# EAGLE design firealarm (EAGLE 9.6.2)
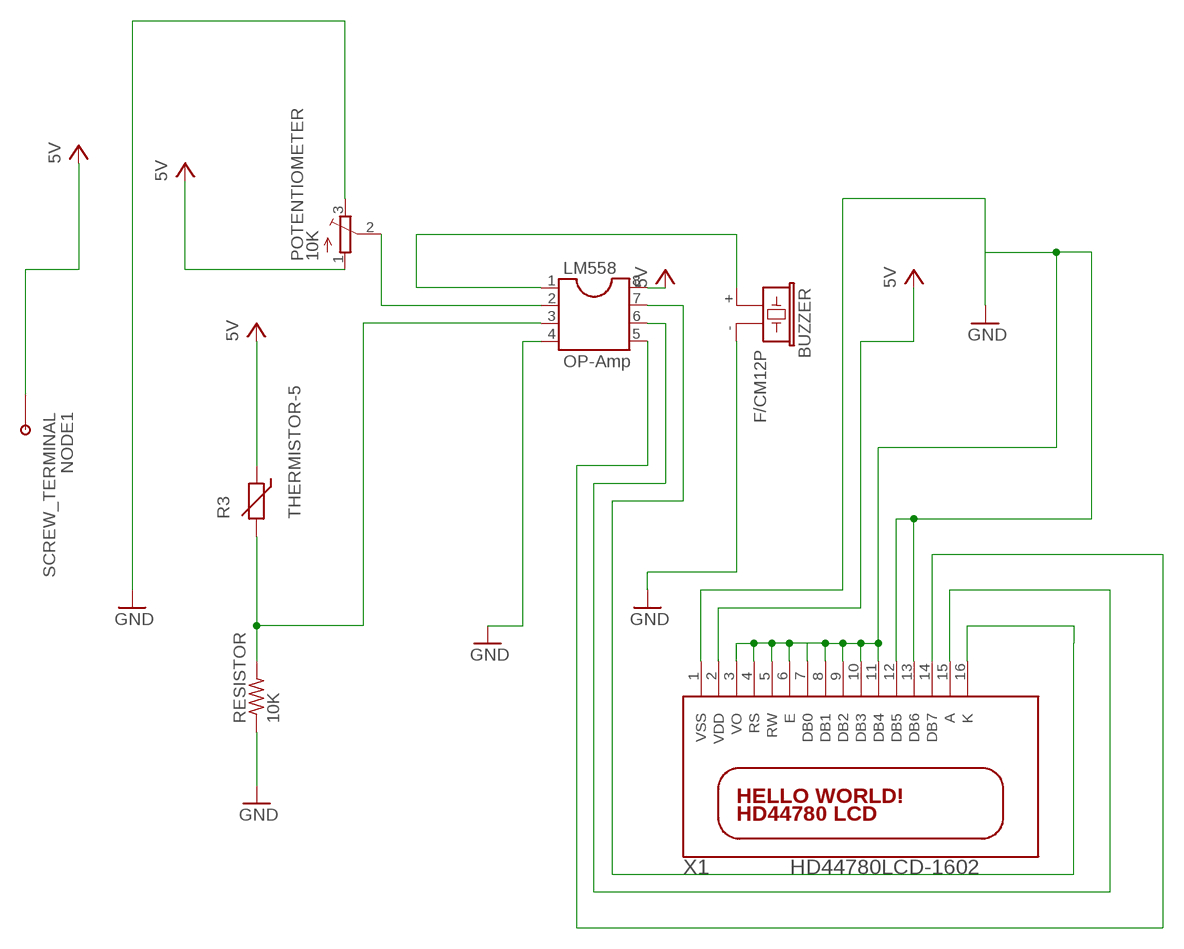
[diagram p0: schematic, sheet 1]

## Parts
BUZZER  F/CM12P  [F/CM12P]
LM558  OP-Amp  DIL8S  [SOCKET-08]
NODE1  SCREW_TERMINAL  PCB_SCREW_TERMINAL  [NINIGI_PCB_1M4]
POTENTIOMETER  10K  TRIM_EU-3223G  [3223G]
R3  THERMISTOR-5  [R-5]
RESISTOR  10K  R-US_0204/2V  [0204V]
X1  HD44780LCD-1602  [LCD1602]

## Nets
GND: BUZZER.- LM558.4 POTENTIOMETER.3(E) RESISTOR.1 X1.1(VSS) X1.3(VO) X1.4(RS) X1.5(RW) X1.6(E) X1.8(DB1) X1.9(DB2) X1.10(DB3) X1.11(DB4) X1.12(DB5) X1.13(DB6)
N$1: BUZZER.+ LM558.1
N$2: LM558.3 R3.2 RESISTOR.2
N$3: LM558.2 POTENTIOMETER.2(S)
N$5: LM558.7 X1.16(K)
N$6: LM558.5 X1.14(DB7)
N$9: LM558.6 X1.15(A)
N$11: X1.7(DB0)
VCC: LM558.8 NODE1.1 NODE1.2 NODE1.3 NODE1.4 NODE1.C POTENTIOMETER.1(A) R3.1 X1.2(VDD) ; supply symbol labelled 5V

## Library data of the parts
BUZZER = buzzer:F/CM12P: BUZZER Source: Buerklin; OC_FARNELL: unknown; OC_NEWARK: unknown
LM558 = ic-package:DIL8: Dual In Line / Socket
NODE1 = screw-terminals:PCB_SCREW_TERMINAL
POTENTIOMETER = pot:TRIM_EU-: POTENTIOMETER
R3 = varistor:THERMISTOR: THERMISTOR
RESISTOR = adafruit:R-US_: RESISTOR, American symbol
X1 = adafruit:HD44780LCD: HD44780 LCD Standard character type LCDs, available in sizes from 8x1 to 40x4!

## Board
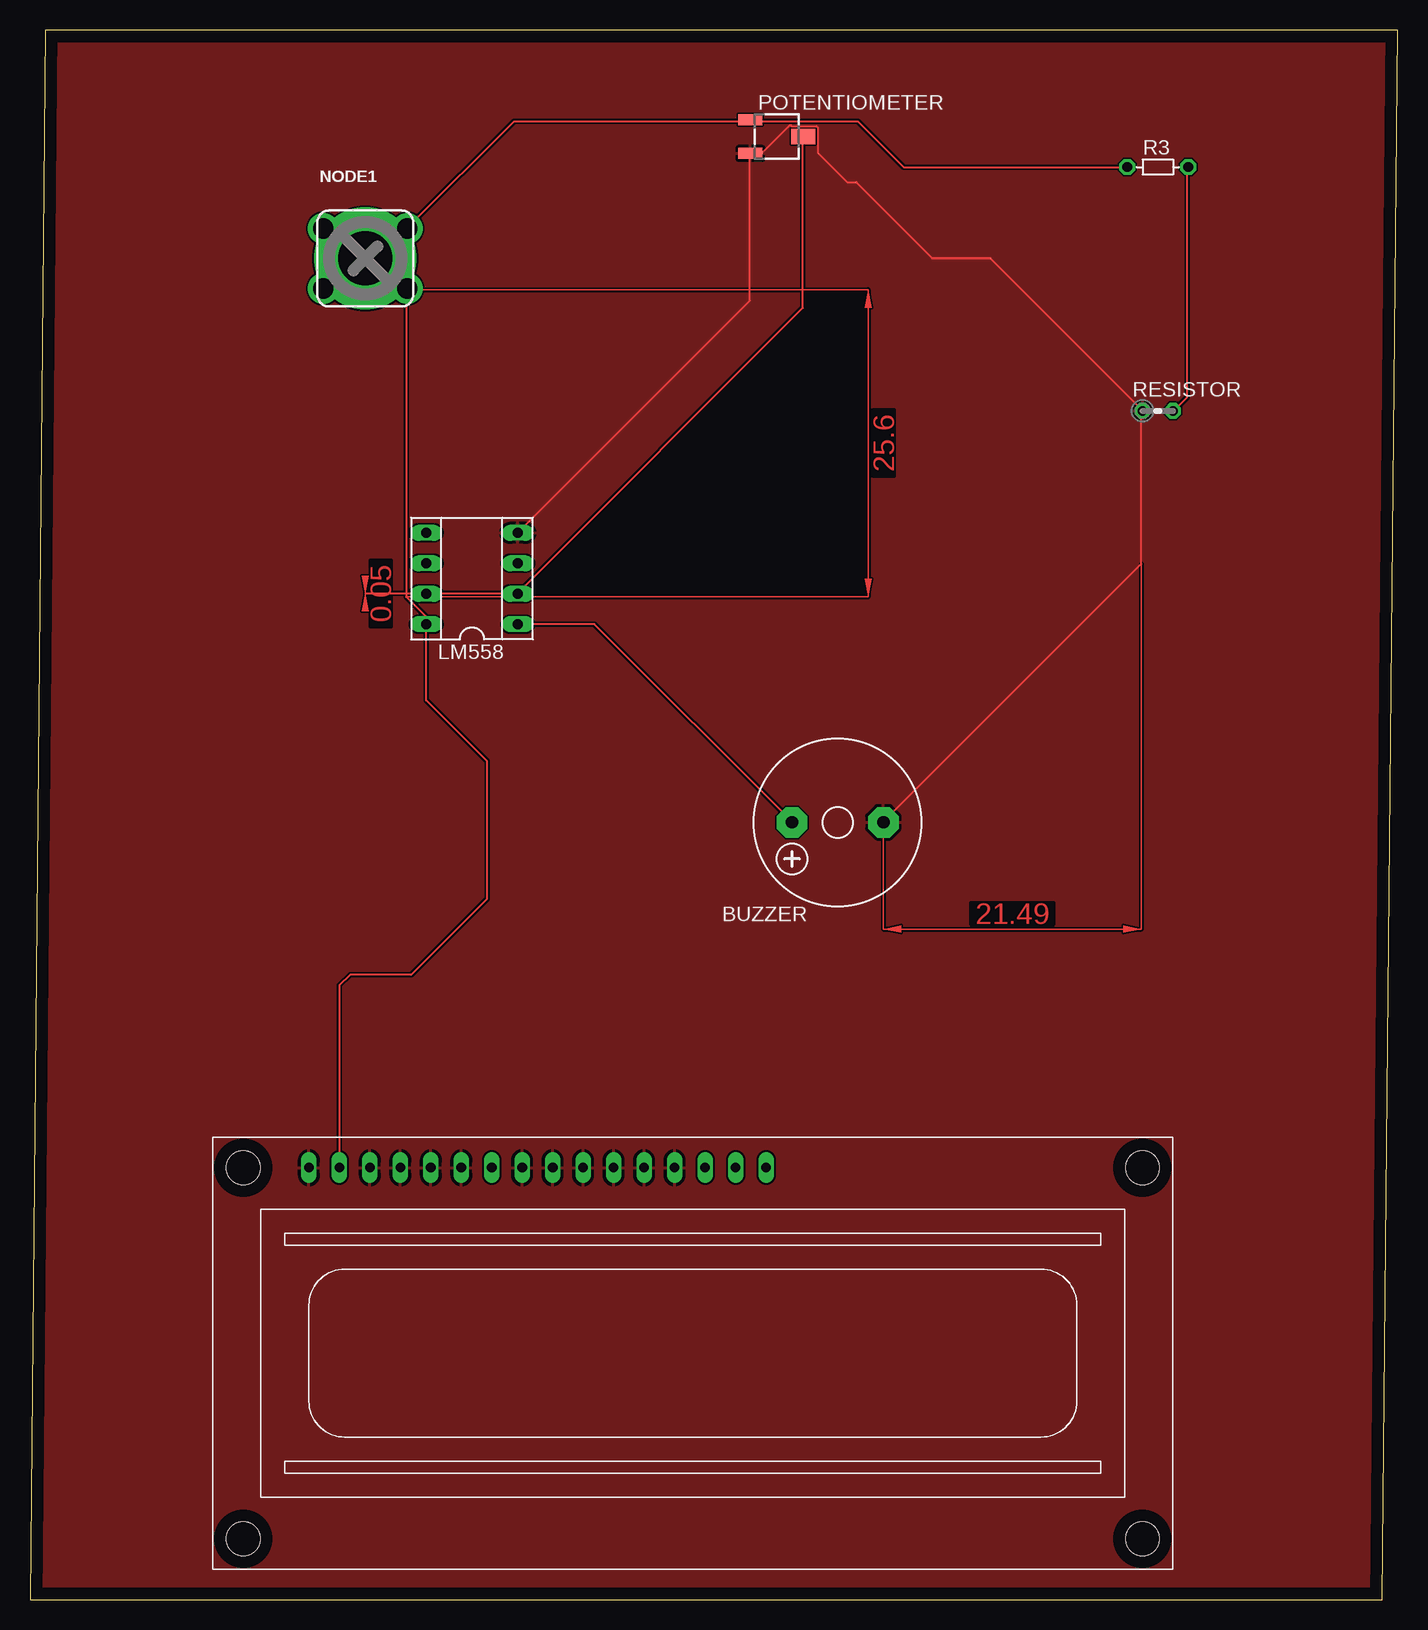
[diagram p1: board, top side]
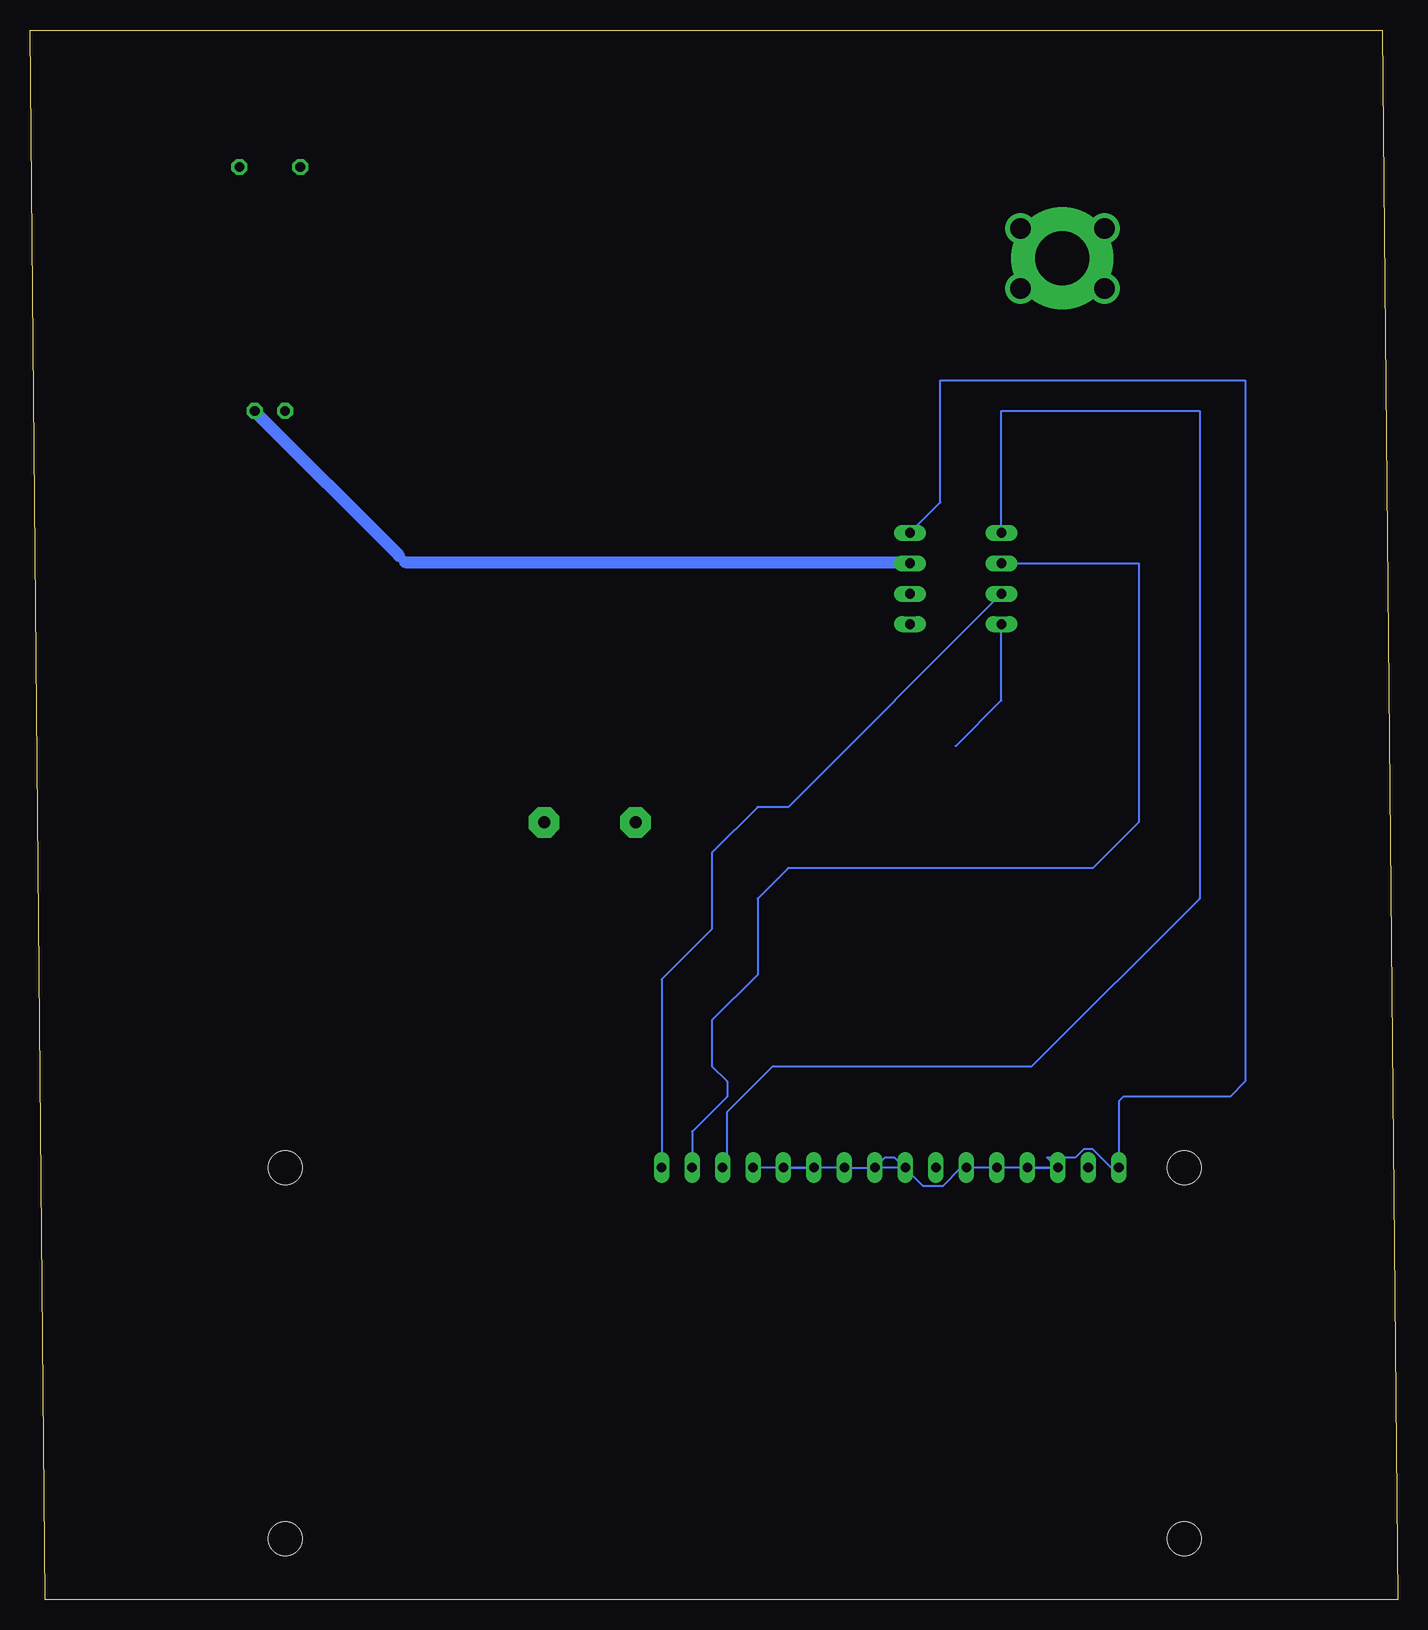
[diagram p2: board, bottom side, seen from below]

Size 113.97 x 130.8 mm. Coordinates in mm from the lower left corner, seen from the top.
Outline: 0,0 112.7,0 113.97,130.8 1.27,130.8 0,0
Copper layers (1*16): Top 0.035mm / dielectric 1.5mm / Bottom 0.035mm
Design rules "default": minimum track width 6mil, minimum drill 0.35mm, track to track 6mil, track to pad 6mil, pad to pad 6mil, via to via 6mil, smd to smd 6mil, copper to edge 40mil, drill to drill 6mil, minimum pad ring 10mil, minimum via ring 8mil, stop-mask expansion 4mil, vias tented up to drill 0mil, thermal gap 10mil

### Footprints (pad centres in the part's own frame; a part is rotated, then mirrored left to right if it is on the bottom)
F/CM12P = drill 1.016 pad 2.54 octagon: + 3.81,0; - -3.81,0
SOCKET-08 = drill 0.813 long: 1 -3.81,-3.81; 2 -1.27,-3.81; 3 1.27,-3.81; 4 3.81,-3.81; 5 3.81,3.81; 6 1.27,3.81; 7 -1.27,3.81; 8 -3.81,3.81
NINIGI_PCB_1M4 = drill 1.7: 1 -3.5,2.5; 2 -3.5,-2.5; 3 3.5,-2.5; 4 3.5,2.5 | drill 4.5 pad 8.5: C 0,0
3223G = smd 2 x 0.9: 1 -2.2,1.4; 3 -2.2,-1.4 | smd 2 x 1.3: 2 2.2,0
R-5 = drill 0.813 octagon: 1 -2.54,0; 2 2.54,0
0204V = drill 0.813 octagon: 1 -1.27,0; 2 1.27,0
LCD1602 = drill 0.8 long: 1 8,33.46; 2 10.54,33.46; 3 13.08,33.46; 4 15.62,33.46; 5 18.16,33.46; 6 20.7,33.46; 7 23.24,33.46; 8 25.78,33.46; 9 28.32,33.46; 10 30.86,33.46; 11 33.4,33.46; 12 35.94,33.46; 13 38.48,33.46; 14 41.02,33.46; 15 43.56,33.46; 16 46.1,33.46 | hole 2.8: 2.54,2.54; 2.54,33.46; 77.46,33.46; 77.46,2.54

### Placement (x,y rotation side)
BUZZER  67.31,64.77 180 top
LM558  36.83,85.09 90 top
NODE1  27.94,111.76 0 top
POTENTIOMETER  62.23,121.92 0 top
R3  93.98,119.38 0 top
RESISTOR  93.98,99.06 0 top
X1  15.24,2.54 0 top

### Tracks (layer width: path | path; a pad name or v marks a point on that pad's centre or on a via)
GND
  Top 0.152: LM558.4 60,108.25 60,120.45 POTENTIOMETER.3 60.15,120.6 61.06,120.6 63.35,122.88 63.43,122.8 65.53,122.8 65.66,122.66 65.66,120.57 68.12,118.11 68.83,118.11 | BUZZER.- 71.12,64.82 92.61,86.31 92.61,98.96 RESISTOR.1 92.61,99.11
  Top 0.203: 68.83,118.11 75.18,111.76 80.01,111.76 RESISTOR.1
  Bottom 0.152: LM558.4 38.1,91.44 38.1,101.6 12.7,101.6 12.7,43.18 13.97,41.91 22.86,41.91 23.24,41.53 X1.1 23.88,36 25.41,37.54 26.15,37.54 26.85,36.83 29.21,36.83 28.38,36 X1.3 | X1.3 X1.5 X1.6 36.39,36 37.93,34.46 39.54,34.46 41.91,36.83 42.73,36.83 X1.9 | X1.8 X1.9 | X1.12 X1.13 | X1.4 X1.3 | X1.12 48.26,36 X1.10 X1.9 | X1.11 X1.12
  pour Top: -5.08,132.08 -5.08,-7.62 -3.81,-8.89 116.84,-8.89 119.38,-6.35 120.65,-5.08 120.65,134.62 -5.08,134.62
N$1
  Top 0.152: LM558.1 47.04,81.28 63.5,64.82 BUZZER.+
N$2
  Top 0.152: R3.2 96.42,119.38 96.42,100.18 95.35,99.11 RESISTOR.2
  Bottom 0.152: 95.2,98.96 RESISTOR.2
  Bottom 0.508: 82.7,86.46 83.21,86.97
  Bottom 1.016: LM558.3 40.74,86.46 82.7,86.46 | 83.21,86.97 95.2,98.96
N$3
  Top 0.152: POTENTIOMETER.2 64.41,121.82 64.41,107.65 40.64,83.87 LM558.2
N$5
  Bottom 0.152: LM558.7 50.8,66.04 53.34,66.04 57.15,62.23 57.15,55.88 61.34,51.69 X1.16
N$6
  Bottom 0.152: LM558.5 33.02,99.06 16.51,99.06 16.51,58.42 30.48,44.45 52.07,44.45 55.88,40.64 55.88,36.38 X1.14
N$9
  Bottom 0.152: LM558.6 21.59,86.36 21.59,64.77 25.4,60.96 50.8,60.96 53.34,58.42 53.34,52.07 57.15,48.26 57.15,44.45 55.88,43.18 55.88,41.91 58.8,38.99 X1.15
VCC
  Top 0.152: 31.34,109.17 31.34,83.57 33.02,81.89 LM558.8 33.02,74.93 38.1,69.85 38.1,58.42 31.75,52.07 26.67,52.07 25.78,51.18 X1.2 | 27.38,111.3 27.84,111.76 NODE1.C | 27.38,111.3 25.4,109.32 24.49,109.32 NODE1.2 | 31.34,109.17 NODE1.3 | 31.34,109.17 NODE1.C | 27.38,111.3 24.49,114.2 NODE1.1 | 27.38,111.3 NODE1.C | R3.1 72.8,119.38 68.99,123.19 60.15,123.19 POTENTIOMETER.1 60,123.19 40.34,123.19 31.5,114.35 NODE1.4 31.5,114.2 28.6,111.3 NODE1.C
  Bottom 0.152: 36.83,71.12 33.02,74.93 LM558.8
(copper drawn outside any net)
  shapes: Top area x3